# EAGLE board avocado_v1.0 (EAGLE 8.6.0)
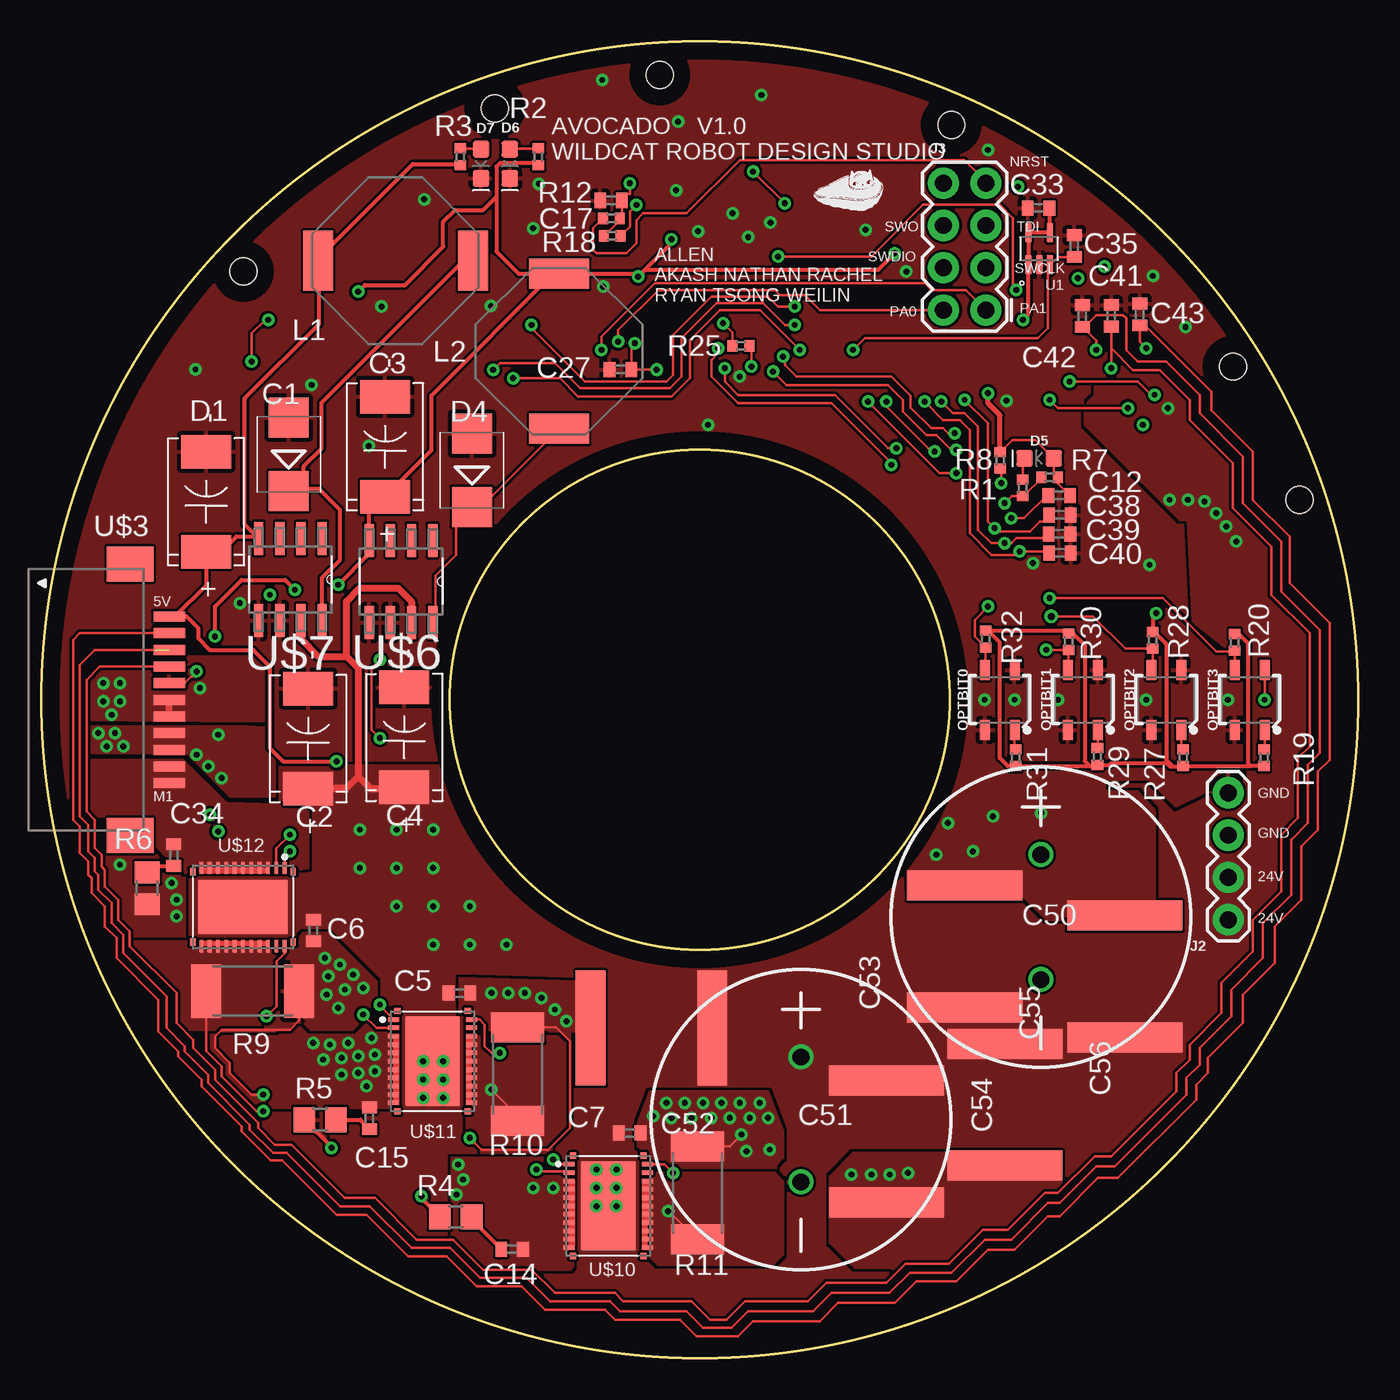
[diagram p2: board, top side]
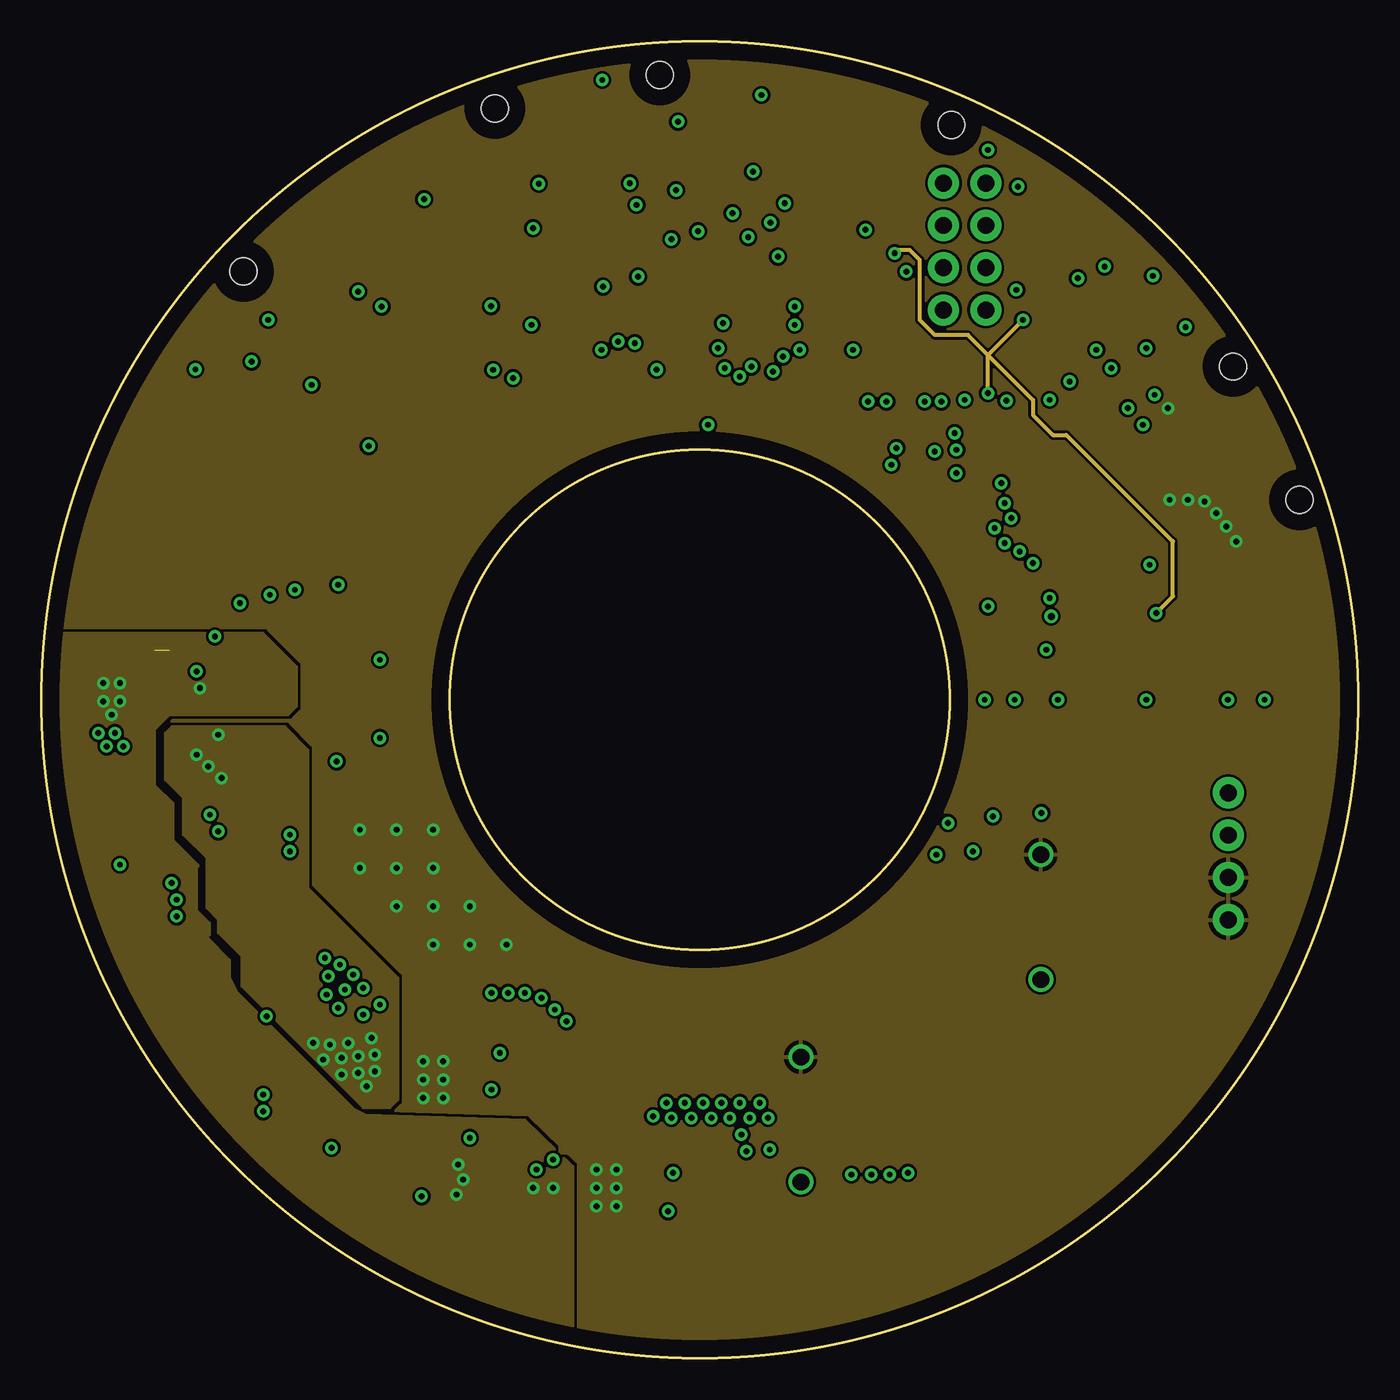
[diagram p3: board, inner layer Route2]
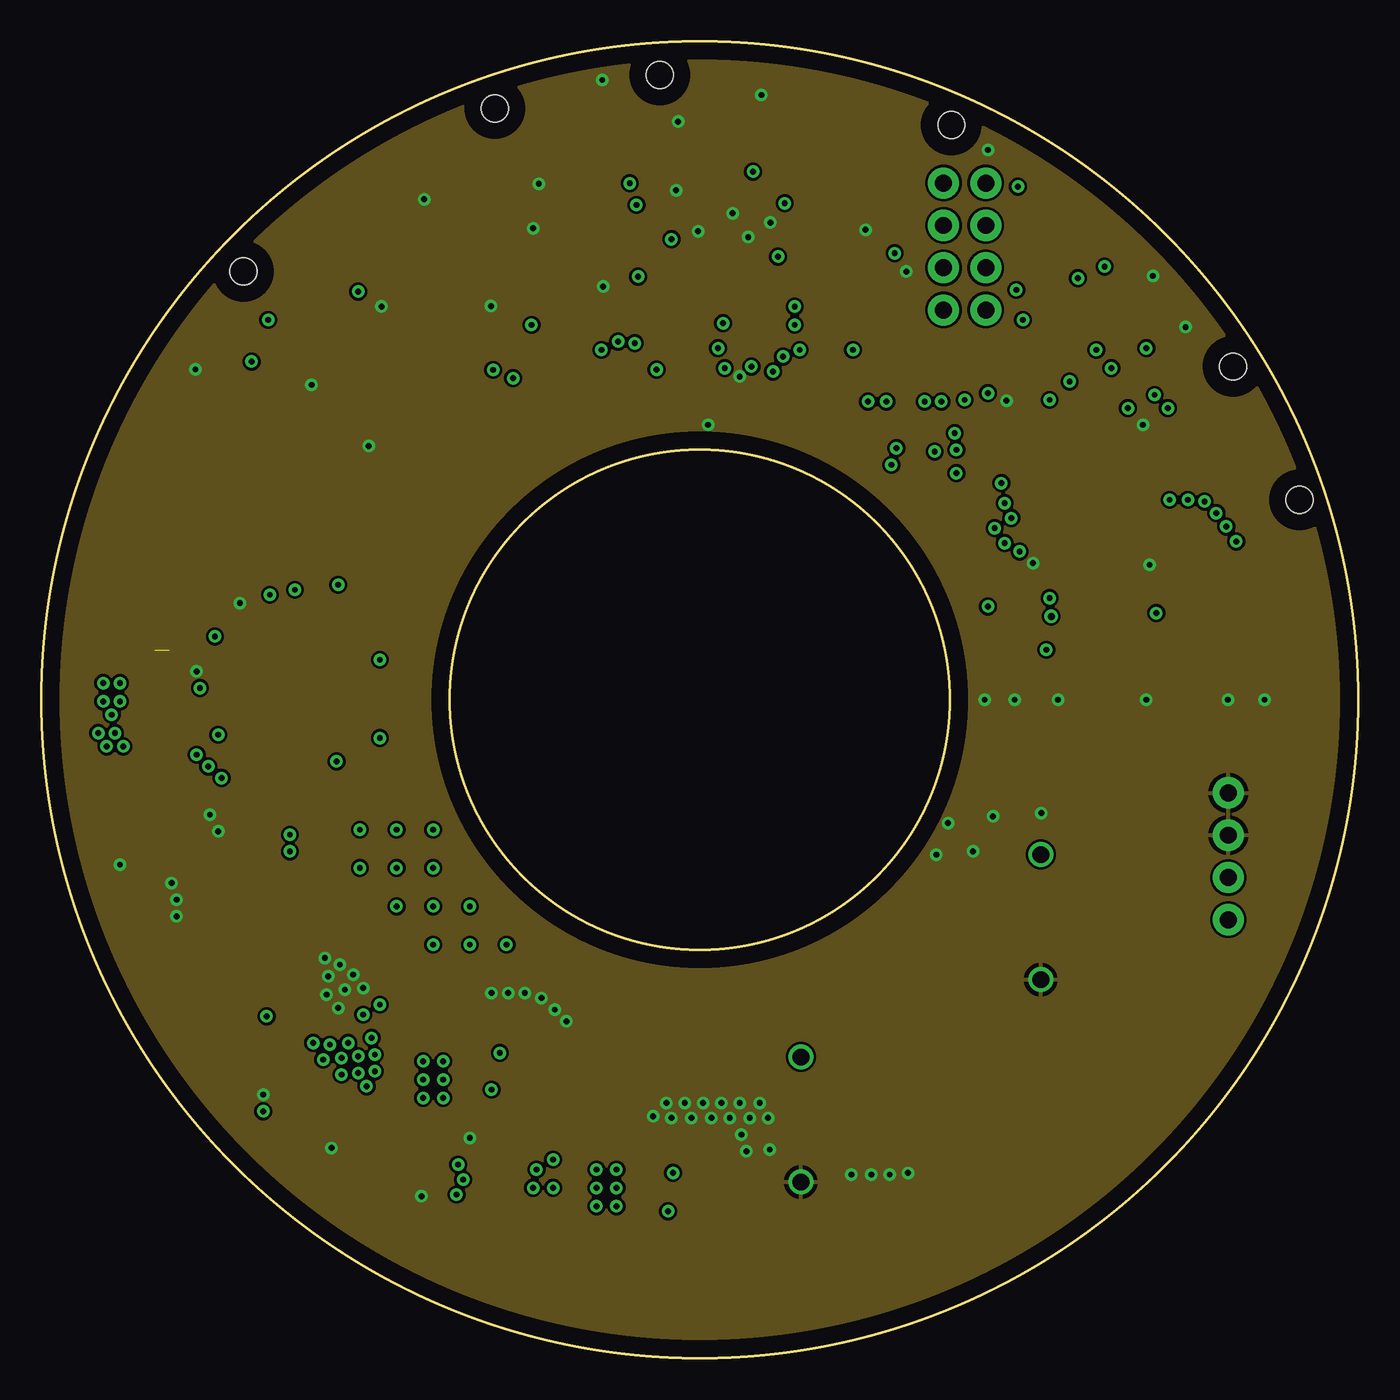
[diagram p4: board, inner layer Route15]
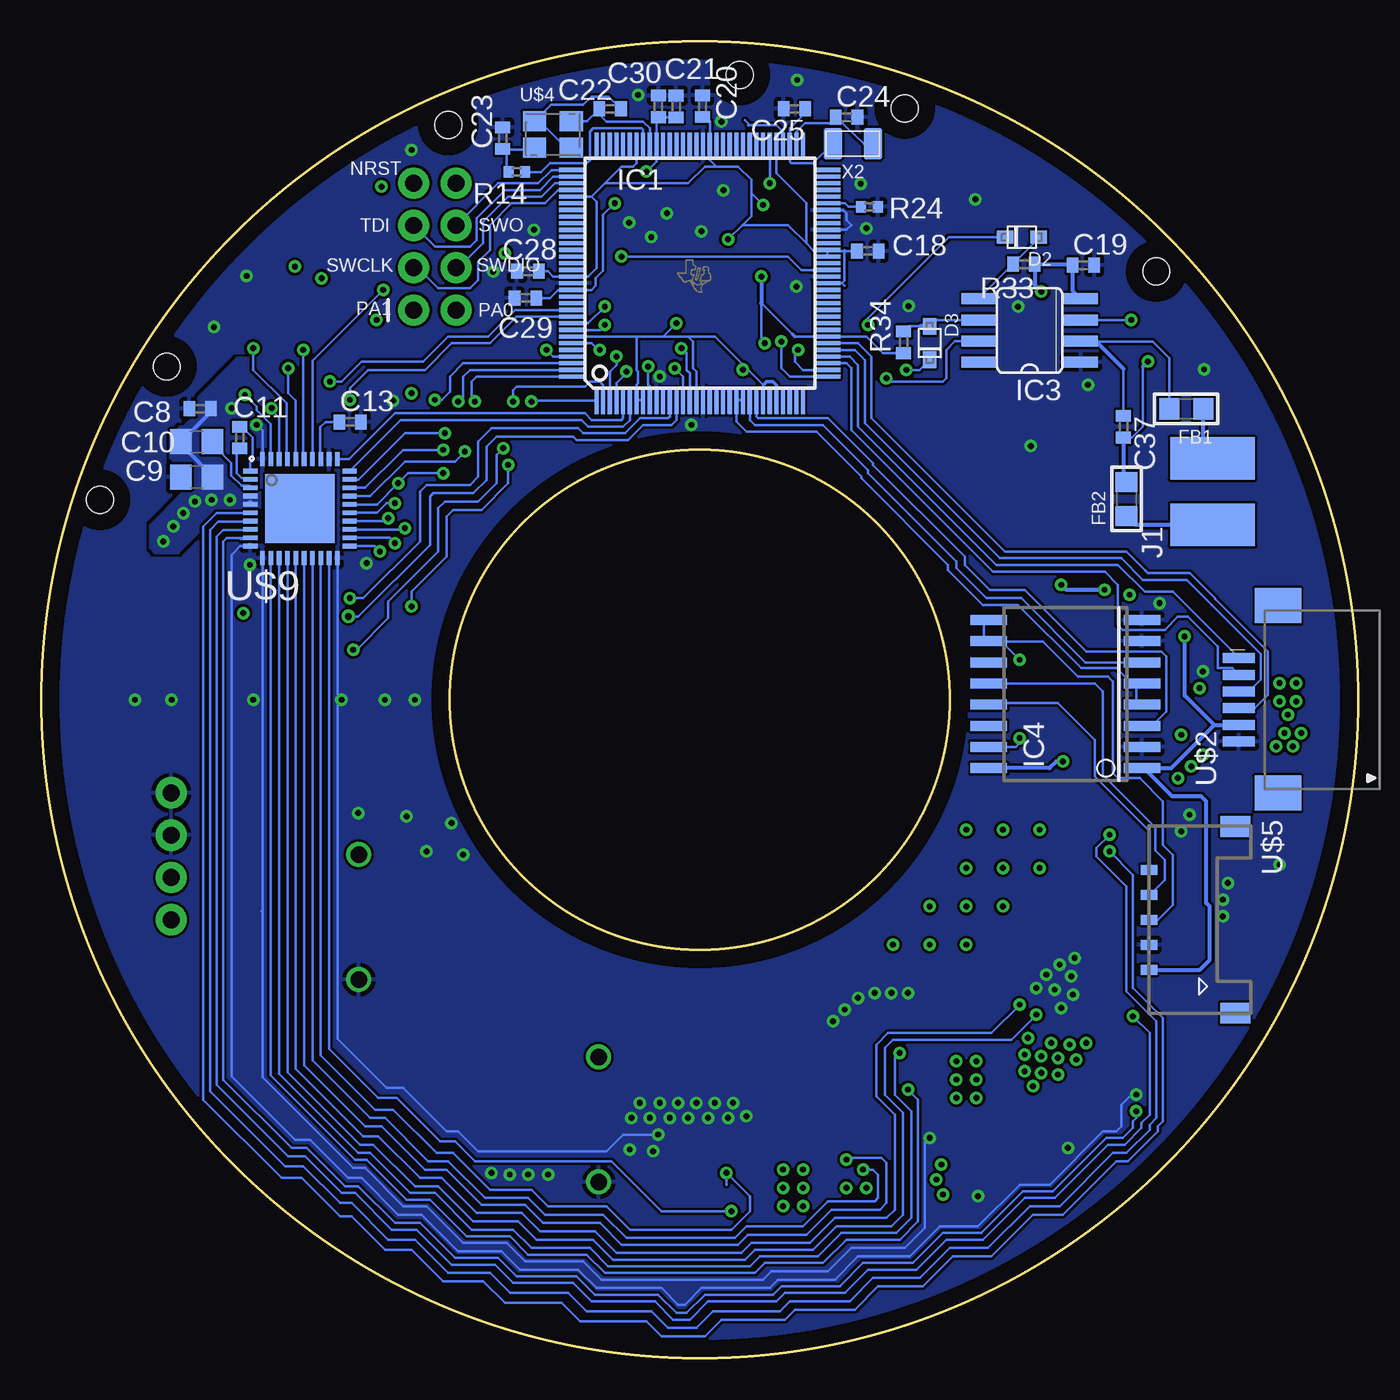
[diagram p5: board, bottom side, seen from below]

Size 79 x 79 mm. Coordinates in mm from the lower left corner, seen from the top.
Outline: circle at 39.5,39.5 radius 39.5
Outline: circle at 39.5,39.5 radius 15
Copper layers ((1*2)+(15*16)): Top 0.07mm / dielectric 0.36mm / Route2 0.0525mm / dielectric 0.71mm / Route15 0.0525mm / dielectric 0.36mm / Bottom 0.07mm
Design rules "default *": minimum track width 6mil, minimum drill 0.35mm, track to track 6mil, track to pad 6mil, pad to pad 6mil, via to via 6mil, smd to smd 6mil, copper to edge 40mil, drill to drill 6mil, minimum pad ring 10mil, minimum via ring 8mil, stop-mask expansion 4mil, vias tented up to drill 0mil, thermal gap 10mil
Holes 1.6 mm at 75.5,51.5 71.5,59.5 54.6,74 37.1,77 12.1,65.2 27.2,75

## Footprints (pad centres in the part's own frame; a part is rotated, then mirrored left to right if it is on the bottom)
2917-D = smd 2 x 3: + 3,0; - -3,0
C0402 = smd 0.7 x 0.9: 1 -0.65,0; 2 0.65,0
C0805 = smd 1.3 x 1.5: 1 -0.95,0; 2 0.95,0
UPJXXXXXMHD6 = drill 1: + -3.75,0; - 3.75,0
3025 = smd 1.8 x 6.9: P$1 -3.65,0; P$2 3.65,0
SMB = smd 2.4 x 2.4: A 2.2,0; C -2.2,0
SOD-323F = smd 1 x 0.8: A -1,0; C 1,0
LED-0603 = smd 1 x 1: A -0.877,0; C 0.877,0
_0805 = smd 1.2 x 1.3: 1 -1.016,0; 2 1.016,0
PDT_S-PQFP-G128 = smd 0.245 x 1.6: 1 -6.2,-7.65; 2 -5.8,-7.65; 3 -5.4,-7.65; 4 -5,-7.65; 5 -4.6,-7.65; 6 -4.2,-7.65; 7 -3.8,-7.65; 8 -3.4,-7.65; 9 -3,-7.65; 10 -2.6,-7.65; 11 -2.2,-7.65; 12 -1.8,-7.65; 13 -1.4,-7.65; 14 -1,-7.65; 15 -0.6,-7.65; 16 -0.2,-7.65; 17 0.2,-7.65; 18 0.6,-7.65; 19 1,-7.65; 20 1.4,-7.65; 21 1.8,-7.65; 22 2.2,-7.65; 23 2.6,-7.65; 24 3,-7.65; 25 3.4,-7.65; 26 3.8,-7.65; 27 4.2,-7.65; 28 4.6,-7.65; 29 5,-7.65; 30 5.4,-7.65; 31 5.8,-7.65; 32 6.2,-7.65; 65 6.2,7.65; 66 5.8,7.65; 67 5.4,7.65; 68 5,7.65; 69 4.6,7.65; 70 4.2,7.65; 71 3.8,7.65; 72 3.4,7.65; 73 3,7.65; 74 2.6,7.65; 75 2.2,7.65; 76 1.8,7.65; 77 1.4,7.65; 78 1,7.65; 79 0.6,7.65; 80 0.2,7.65; 81 -0.2,7.65; 82 -0.6,7.65; 83 -1,7.65; 84 -1.4,7.65; 85 -1.8,7.65; 86 -2.2,7.65; 87 -2.6,7.65; 88 -3,7.65; 89 -3.4,7.65; 90 -3.8,7.65; 91 -4.2,7.65; 92 -4.6,7.65; 93 -5,7.65; 94 -5.4,7.65; 95 -5.8,7.65; 96 -6.2,7.65 | smd 1.6 x 0.245: 33 7.65,-6.2; 34 7.65,-5.8; 35 7.65,-5.4; 36 7.65,-5; 37 7.65,-4.6; 38 7.65,-4.2; 39 7.65,-3.8; 40 7.65,-3.4; 41 7.65,-3; 42 7.65,-2.6; 43 7.65,-2.2; 44 7.65,-1.8; 45 7.65,-1.4; 46 7.65,-1; 47 7.65,-0.6; 48 7.65,-0.2; 49 7.65,0.2; 50 7.65,0.6; 51 7.65,1; 52 7.65,1.4; 53 7.65,1.8; 54 7.65,2.2; 55 7.65,2.6; 56 7.65,3; 57 7.65,3.4; 58 7.65,3.8; 59 7.65,4.2; 60 7.65,4.6; 61 7.65,5; 62 7.65,5.4; 63 7.65,5.8; 64 7.65,6.2; 97 -7.65,6.2; 98 -7.65,5.8; 99 -7.65,5.4; 100 -7.65,5; 101 -7.65,4.6; 102 -7.65,4.2; 103 -7.65,3.8; 104 -7.65,3.4; 105 -7.65,3; 106 -7.65,2.6; 107 -7.65,2.2; 108 -7.65,1.8; 109 -7.65,1.4; 110 -7.65,1; 111 -7.65,0.6; 112 -7.65,0.2; 113 -7.65,-0.2; 114 -7.65,-0.6; 115 -7.65,-1; 116 -7.65,-1.4; 117 -7.65,-1.8; 118 -7.65,-2.2; 119 -7.65,-2.6; 120 -7.65,-3; 121 -7.65,-3.4; 122 -7.65,-3.8; 123 -7.65,-4.2; 124 -7.65,-4.6; 125 -7.65,-5; 126 -7.65,-5.4; 127 -7.65,-5.8; 128 -7.65,-6.2
SO08 = smd 0.66 x 2.032: 1 -1.905,-3.073; 2 -0.635,-3.073; 3 0.635,-3.073; 4 1.905,-3.073; 5 1.905,3.073; 6 0.635,3.073; 7 -0.635,3.073; 8 -1.905,3.073
SOIC16 = smd 0.6 x 2.2: 1 -4.445,-4.6; 2 -3.175,-4.6; 3 -1.905,-4.6; 4 -0.635,-4.6; 5 0.635,-4.6; 6 1.905,-4.6; 7 3.175,-4.6; 8 4.445,-4.6; 9 4.445,4.6; 10 3.175,4.6; 11 1.905,4.6; 12 0.635,4.6; 13 -0.635,4.6; 14 -1.905,4.6; 15 -3.175,4.6; 16 -4.445,4.6
2_SMP = smd 2.54 x 5.08: 1 -2,0; 2 2,0
1X04 = drill 1.016 pad 1.88: 1 0,0; 2 2.54,0; 3 5.08,0; 4 7.62,0
2X4 = drill 1.016 pad 1.88: 1 -3.81,-1.27; 2 -3.81,1.27; 3 -1.27,-1.27; 4 -1.27,1.27; 5 1.27,-1.27; 6 1.27,1.27; 7 3.81,-1.27; 8 3.81,1.27
SRU1028 = smd 1.8 x 3.6: 1 -4.65,0; 2 4.65,0
QRE1113 = smd 1.2 x 0.6: 1 -1.8,-0.9; 2 1.8,-0.9; 3 1.8,0.9; 4 -1.8,0.9
R0402 = smd 0.6 x 0.7: 1 -0.5,0; 2 0.5,0
R0805 = smd 1.3 x 1.5: 1 -0.95,0; 2 0.95,0
R2512 = smd 1.8 x 3.2: 1 -2.8,0; 2 2.8,0
R0402' = smd 0.7 x 0.9: 1 -0.65,0; 2 0.65,0
SOT65P210X110-5N = smd 1.19 x 0.4: 1 -0.96,0.65; 2 -0.96,0; 3 -0.96,-0.65; 4 0.96,-0.65; 5 0.96,0.65
1MM-FPC-6PIN = smd 0.6 x 1.9: 1 -2.5,3.25; 2 -1.5,3.25; 3 -0.5,3.25; 4 0.5,3.25; 5 1.5,3.25; 6 2.5,3.25 | smd 2.1 x 2.8: THERMPAD 5.65,0.9; THERMPAD1 -5.6,0.9
1MM-FPC-11PIN = smd 0.6 x 1.9: 1 -5,3.25; 2 -4,3.25; 3 -3,3.25; 4 -2,3.25; 5 -1,3.25; 6 0,3.25; 7 1,3.25; 8 2,3.25; 9 3,3.25; 10 4,3.25; 11 5,3.25 | smd 2.1 x 2.8: THERMPAD 8.15,0.9; THERMPAD1 -8.15,0.9
NX3225GA = smd 1.4 x 1.2: P$1 1.1,0.8; P$2 -1.1,0.8; P$3 -1.1,-0.8; P$4 1.1,-0.8
5040500591 = smd 0.6 x 1: 1 3,-2.54; 2 1.5,-2.54; 3 0,-2.54; 4 -1.5,-2.54; 5 -3,-2.54 | smd 1.25 x 1.8: P$7 5.605,2.65; P$8 -5.605,2.65
SOIC127P620X175-8N = smd 1.981 x 0.559: 1 -2.464,1.905; 2 -2.464,0.635; 3 -2.464,-0.635; 4 -2.464,-1.905; 5 2.464,-1.905; 6 2.464,-0.635; 7 2.464,0.635; 8 2.464,1.905
DRV8323S = smd 0.28 x 0.85: AGND 1.75,2.975; CAL 2.25,2.975; DVDD 1.25,2.975; GHB -0.25,-2.975; GHC 0.25,-2.975; GLB -1.25,-2.975; GLC 1.25,-2.975; INHA 0.75,2.975; INHB -0.25,2.975; INHC -1.25,2.975; INLA 0.25,2.975; INLB -0.75,2.975; INLC -1.75,2.975; PGND -2.25,2.975; SHB -0.75,-2.975; SHC 0.75,-2.975; SNB -2.25,-2.975; SNC 2.25,-2.975; SPB -1.75,-2.975; SPC 1.75,-2.975 | smd 0.85 x 0.28: CPH -2.975,1.75; CPL -2.975,2.25; ENABLE 2.975,2.25; GHA -2.975,-0.25; GLA -2.975,-1.25; N_FAULT 2.975,-0.25; N_SCS 2.975,1.75; SCLK 2.975,1.25; SDI 2.975,0.75; SDO 2.975,0.25; SHA -2.975,-0.75; SNA -2.975,-2.25; SOA 2.975,-1.25; SOB 2.975,-1.75; SOC 2.975,-2.25; SPA -2.975,-1.75; VCP -2.975,1.25; VDRAIN -2.975,0.25; VM -2.975,0.75; VREF 2.975,-0.75 | smd 4.15 x 4.15: P$41 0,0
MOSFET_CSD88599Q5DC = smd 0.7 x 0.25: 1 -2.35,2.5; 2 -2.35,2; 3 -2.35,1.5; 4 -2.35,1; 5 -2.35,0.5; 6 -2.35,0; 7 -2.35,-0.5; 8 -2.35,-1; 9 -2.35,-1.5; 10 -2.35,-2; 11 -2.35,-2.5; 12 2.35,-2.5; 13 2.35,-2; 14 2.35,-1.5; 15 2.35,-1; 16 2.35,-0.5; 17 2.35,0; 18 2.35,0.5; 19 2.35,1; 20 2.35,1.5; 21 2.35,2; 22 2.35,2.5 | smd 0.43 x 0.375: 23 -2.115,3.013; 24 -2.115,-3.013; 25 2.115,-3.013; 26 2.115,3.013 | smd 3.3 x 5.4: 27 0,0
ABRACON-ABS07-32.768KHZ = smd 1.1 x 1.9: P$1 -1.2,0; P$2 1.2,0

## Placement (x,y rotation side)
C1  100u  [2917-D]  9.87,51.38 270 top
C2  15u  [2917-D]  16,37.16 270 top
C3  100u  [2917-D]  20.61,54.68 270 top
C4  15u  [2917-D]  21.77,37.25 270 top
C5  10nF  [C0402]  25.07,21.89 0 top
C6  10nF  [C0402]  16.31,25.65 270 top
C7  10nF  [C0402]  35.3,13.49 0 top
C8  0.1uF  [C0402]  69.48,56.97 180 bottom
C9  10uF  [C0805]  69.69,52.87 180 bottom
C10  1uF  [C0805]  69.7,54.98 0 bottom
C11  0.047uF  [C0402]  67.11,55.23 90 bottom
C12  0.1uF  [C0402]  61.07,51.77 180 top
C13  1uF  [C0402]  60.48,56.18 0 bottom
C14  4.7nF  [C0402]  28.24,6.52 180 top
C15  4.7nF  [C0402]  19.68,14.39 270 top
C17  0.1uF  [C0402]  34.17,69.47 180 top
C18  0.1uF  [C0402]  29.42,66.43 0 bottom
C19  10uF  [C0402]  16.48,65.58 0 bottom
C20  0.1uF  [C0402]  39.34,75.12 90 bottom
C21  0.1uF  [C0402]  40.92,75.11 90 bottom
C22  12pF  [C0402]  44.88,74.96 0 bottom
C23  12pF  [C0402]  51.32,73.21 90 bottom
C24  12pF  [C0402]  30.68,74.46 0 bottom
C25  12pF  [C0402]  33.82,74.97 180 bottom
C27  0.1uF  [C0402]  34.73,59.32 180 top
C28  0.1uF  [C0402]  49.82,65.22 180 bottom
C29  0.1uF  [C0402]  49.97,63.62 180 bottom
C30  2.2uF  [C0402]  41.98,75.12 90 bottom
C33  0.1uF  [C0402]  59.83,69.02 180 top
C34  4.7nF  [C0402]  7.93,30.18 270 top
C35  0.01uF  [C0402]  61.97,66.73 90 top
C37  0.01uF  [C0402]  14.07,55.89 270 bottom
C38  2200pF  [C0402]  61.12,50.59 0 top
C39  2200pF  [C0402]  61.09,49.45 0 top
C40  2200pF  [C0402]  61.12,48.31 0 top
C41  1000pF  [C0402]  64.2,62.55 90 top
C42  1000pF  [C0402]  62.45,62.54 90 top
C43  1000pF  [C0402]  65.9,62.63 90 top
C50  UPJXXXXXMHD6  [UPJXXXXXMHD6]  59.97,26.46 270 top
C51  UPJXXXXXMHD6  [UPJXXXXXMHD6]  45.57,14.31 270 top
C52  C7563  [3025]  36.6,19.8 180 top
C53  C7563  [3025]  55.4,24.7 90 top
C54  C7563  [3025]  50.7,13 270 top
C55  C7563  [3025]  65,22.9 90 top
C56  C7563  [3025]  57.8,15.2 270 top
D1  MBRS130LT3  [SMB]  14.83,54.23 90 top
D2  1n4148  [SOD-323F]  20.16,67.27 180 bottom
D3  1N4148  [SOD-323F]  25.7,60.91 270 bottom
D4  MBRS130LT3  [SMB]  25.82,53.27 90 top
D5  RED  [LED-0603]  59.87,53.99 180 top
D6  GREEN  [LED-0603]  28.1,71.67 270 top
D7  BLUE  [LED-0603]  26.37,71.67 270 top
FB1  Ferrite  [_0805]  10.3,56.96 180 bottom
FB2  Ferrite  [_0805]  13.89,51.55 90 bottom
IC1  TM4C129XXXPDT  [PDT_S-PQFP-G128]  39.5,65.1 0 bottom
IC3  MAX31855  [SO08]  19.7,61.66 90 bottom
IC4  ISO3088  [SOIC16]  17.56,39.84 90 bottom
J1  THERMOCOUPLE  [2_SMP]  8.72,51.99 90 bottom
J2  [1X04]  71.23,26.29 90 top
J3  [2X4]  55.4,66.7 90 top
L1  SRU1028  [SRU1028]  21.23,65.85 180 top
L2  SRU1028  [SRU1028]  31.06,60.41 90 top
OPTBIT0  [QRE1113]  57.5,39.5 90 top
OPTBIT1  [QRE1113]  62.5,39.5 90 top
OPTBIT2  [QRE1113]  67.5,39.5 90 top
OPTBIT3  [QRE1113]  72.5,39.5 90 top
R1  330  [R0402]  58.88,52.22 270 top
R2  330  [R0402]  29.81,72.09 90 top
R3  330  [R0402]  25.14,72.09 90 top
R4  2.21  [R0805]  24.85,8.46 0 top
R5  2.21  [R0805]  16.72,14.3 0 top
R6  2.21  [R0805]  6.34,28.19 90 top
R7  10K  [R0402]  60.5,52.85 0 top
R8  1.5K  [R0402]  57.52,53.87 90 top
R9  0.014  [R2512]  12.67,22.02 180 top
R10  0.014  [R2512]  28.56,17.02 270 top
R11  0.014  [R2512]  39.36,9.9 270 top
R12  10K  [R0402]  34.2,68.4 0 top
R14  2K  [R0402]  50.49,71.17 180 bottom
R18  10K  [R0402]  34.24,67.33 0 top
R19  100  [R0402]  73.36,36.02 270 top
R20  10K  [R0402]  71.61,42.95 90 top
R24  4.87K 1%  [R0402]  29.32,69.09 180 bottom
R25  [R0402]  41.97,60.74 180 top
R27  100  [R0402]  68.52,36.02 270 top
R28  10K  [R0402]  66.69,43.07 90 top
R29  100  [R0402]  63.37,36.09 270 top
R30  10K  [R0402]  61.63,42.99 90 top
R31  100  [R0402]  58.45,36.02 270 top
R32  10K  [R0402]  56.66,43.15 90 top
R33  10K  [R0402']  20.05,65.63 180 bottom
R34  10K  [R0402']  27.27,60.95 90 bottom
U1  LMT87DCKT  [SOT65P210X110-5N]  59.87,66.58 90 top
U$2  0522070633  [1MM-FPC-6PIN]  3.9,39.5 90 bottom
U$3  EC45FLAT_BLDC  [1MM-FPC-11PIN]  4.42,39.5 270 top
U$4  NX3225GA  [NX3225GA]  48.31,73.42 0 bottom
U$5  5040500591  [5040500591]  10,26.3 270 bottom
U$6  LM2594M-5.0  [SOIC127P620X175-8N]  21.57,46.6 270 top
U$7  LM2594M-5.0  [SOIC127P620X175-8N]  14.93,46.72 270 top
U$9  DRV8323SHOMEMADE  [DRV8323S]  63.5,50.98 0 bottom
U$10  CSD88584Q5DC  [MOSFET_CSD88599Q5DC]  34.01,9.12 0 top
U$11  CSD88584Q5DC  [MOSFET_CSD88599Q5DC]  23.46,17.81 0 top
U$12  CSD88584Q5DC  [MOSFET_CSD88599Q5DC]  12.09,27.06 270 top
X2  [ABRACON-ABS07-32.768KHZ]  30.31,72.88 180 bottom

## Tracks (layer width: path | path; a pad name or v marks a point on that pad's centre or on a via)
3V3DC  (via drill 0.35)
  Top 0.152: 35.4,59.31 C27.1 | 35.4,59.31 v36.91,59.31 | 29.9,71.66 R2.1 29.7,71.7 | 19.84,49.1 U$6.4 | 20.6,51.54 C3.+ | 30.7,65.06 L2.2 31.54,65.06 31.9,64.7 32,64.7 | C33.1 60.52,68.98 | v35.6,60.9 35.4,60.7 35.4,59.31 | v35.8,64.9 35.9,65 | 63.29,35.52 R29.2 63.31,35.59 | R32.2 56.8,43.65 | 61.47,43.65 R30.2 61.9,43.49 | 66.61,43.49 66.66,43.54 | 66.66,43.54 R28.2 | 71.48,43.57 R20.2 71.85,43.45 | 66.94,43.54 66.8,43.54 66.66,43.54 | R27.2 68.47,35.57 68.4,35.5 | C12.1 61,52.49 61,52.7 | 61,52.7 R7.2 | R25.2 41.47,61.53 v40.9,62.1 | v35.7,69.2 35.3,68.8 35.3,67.89 R18.2 | R8.2 58.25,55.1 59.64,55.1 D5.A 60.75,52.95 61,52.7
  Top 0.254: 29.7,71.7 27.5,71.7 27.3,71.5 27.3,69.7 | 27.3,69.7 27.3,66.4 28.64,65.06 30.7,65.06 23.4,57.76 23.4,54.47 C3.+ 19.66,50.74 U$6.4 | 60.52,68.98 U1.4 U1.5 U1.1 59.22,62.62 v58.9,62.3 | v17.8,46.4 19.67,48.27 U$6.4 | L2.2 35.64,65.06 v35.8,64.9 37.8,66.9 v37.8,67.14 | 62.9,35.52 R31.2 57.98,35.52 57.5,36 57.5,42.95 56.8,43.65 61.47,43.65 | 62.9,35.52 63.29,35.52 | R27.2 72.6,35.52 | 61.9,43.49 62.6,42.79 62.6,35.82 62.9,35.52 | 66.8,43.54 67.5,42.84 67.5,35.9 67.9,35.5 | 71.85,43.45 72.4,42.9 72.4,35.72 72.6,35.52 | R29.2 64.09,35.59 64.2,35.7 67.5,35.7 67.7,35.5 67.9,35.5 | 67.9,35.5 68.4,35.5 | v51.2,66.3 50.2,65.3 36.2,65.3 35.9,65 | v19,64 19.4,64.4 21.8,64.4 24.1,66.7 24.1,68.2 24.8,68.9 26.5,68.9 27.3,69.7 | R19.2 72.6,35.52 | v15.2,46.1 14.6,46.7 12,46.7 10.4,45.1 v10.4,43.3 | v66.9,44.7 66.69,44.48 R28.2
  Top 0.305: R8.2 57.52,56.58 56.8,57.3 v56.8,57.9
  Route2 0.152: 51.4,66.5 v51.2,66.3
  Route2 0.254: 56.8,60.2 v58.9,62.3 | v56.8,57.9 56.8,60.2 | 56.8,60.2 55.6,61.4 53.6,61.4 52.7,62.3 52.7,65.9 52.1,66.5 51.4,66.5 | 56.8,60.2 59.5,57.5 59.5,56.6 60.7,55.4 61.5,55.4 67.9,49 67.9,45.7 v66.9,44.7
  Bottom 0.152: C20.1 38.9,74.24 IC1.79 38.9,71.9 38.5,71.5 | 47.17,64.92 IC1.113 | 46,69.7 45.7,69.4 45.7,65.4 46.2,64.9 IC1.113 | IC1.101 46,69.7 | 46,69.7 45.2,70.5 | 45.2,70.5 44.2,71.5 43.5,71.5 43.3,71.7 IC1.90 | 30.81,66.43 C18.1 30.36,66.47 | 30.81,66.43 31.78,66.43 IC1.52 | 12.52,35.54 13.13,35.54 IC4.1 12.52,35.54 | 7.19,37.98 U$2.2 7.25,37.9 | 12.52,35.54 12.39,35.41 12.39,35.51 | 30.97,64.49 30.81,64.34 | 30.97,64.49 31.73,64.49 IC1.47 | 31.73,61.29 IC1.39 | 30.97,64.49 30.81,64.65 30.81,66.43 | 30.81,66.47 30.81,66.43 | 43.31,57.48 43,57.48 IC1.8 | 43.31,57.48 43.31,58.4 43.2,58.51 43.2,59.2 43.3,59.3 43.3,61.29 | 43.31,57.48 IC1.7 | IC1.122 47.12,61.29 43.3,61.29 | 36.76,59.46 35.69,58.4 35.69,57.48 IC1.26 | 36.76,59.46 v36.91,59.31 | IC1.69 34.9,71.1 33.1,69.3 33.1,66.9 | 33.1,66.9 32.7,66.5 IC1.52 | IC1.16 39.7,59.2 39.9,59.4 39.9,61 40.2,61.3 | 41.71,61.29 43.3,61.29 | 40.2,61.3 40.21,61.29 41.71,61.29 | 40.2,61.3 38.59,61.3 36.76,59.46 | 17.5,46.1 v17.8,46.4 | 33.95,61.45 35.8,63.3 35.8,61.1 v35.6,60.9 | 33.8,61.3 IC1.39 | 33.1,66.9 34.2,68 36.94,68 | 36.4,69.9 36.4,70.7 37.2,71.5 38.5,71.5 | 38.5,71.5 39.2,71.5 40.2,70.5 45.2,70.5 | v40.9,62.1 41.71,61.29 | C28.1 48.62,65.22 48.3,64.9 IC1.113 | IC1.52 IC1.51 | v35.7,69.2 36.4,69.9 | 17.18,65.63 C19.1 | R34.1 28.5,60.3 29.5,61.3 IC1.39 | 36.94,68 v37.8,67.14 | 36.4,69.9 36.4,68.54 36.94,68
  Bottom 0.2: 33.95,61.45 33.8,61.3 | 35.69,58.4 35.49,58.6 35.1,58.6 34.9,58.4 IC1.28
  Bottom 0.254: v15.2,46.1 17.5,46.1 | v35.8,64.9 35.8,63.3 | 17.18,65.63 R33.1 19.4,64.4 v19,64 | C19.1 17.13,64.07 IC3.4 | IC4.1 12.7,35.4 | 8.62,37.98 7.19,37.98 | 12.7,35.4 11.2,35.4 8.62,37.98 | 8.62,37.98 10.4,39.75 v10.4,43.3 | 12.3,23.3 9.5,23.3 8.9,23.9 8.9,27.1 9.1,27.3 9.1,33.4 9.4,33.7 11.14,33.7 12.7,35.26 12.7,35.4
  Bottom 0.305: U$5.1 12.3,23.3
5VDC  (via drill 0.35)
  Top 0.152: 25.02,71.66 R3.1 | 16.49,65.86 L1.2 16.64,65.71 | 11.15,48.49 9.93,48.49 C1.+ | 12.98,49.25 U$7.4 | U$3.1 8,44.5
  Top 0.254: 25.02,71.66 22.28,71.66 16.49,65.86 | v17.7,35.8 14.5,35.8 13.7,36.6 13.7,41.5 12.7,42.5 10.1,42.5 9.4,43.2 9.4,43.8 8.7,44.5 8,44.5 9.87,46.37 C1.+ 10.78,48.38 11.7,49.3 12.94,49.3 12.98,49.25 | U$7.4 12.2,50.01 12.2,57.6 16.64,62.04 16.64,65.71
  Bottom 0.254: v17.7,35.8 18.1,35.8 18.5,35.4 IC4.16
24VDC  (via drill 0.35)
  Top 0.152: 22.28,44.22 U$6.7 | 15.57,44.38 U$7.7 15.57,44.22 | 21.67,34.17 C4.+ | 16.18,34.17 16.03,34.17 C2.+ 16.1,34.16 16.18,34.17
  Top 0.305: 22.2,43.2 U$6.7 | 15.57,43.43 15.57,44.22 | C4.+ 21.2,34.24 20.77,33.81
  Top 0.406: U$7.7 15.57,43.13 16.6,42.1 18.3,42.1 | 16.1,34.16 18.26,34.16 19,34.9 | 19,34.9 19,41.4 18.3,42.1 | 19,34.9 19.73,34.17 21.67,34.17 | 18.3,42.1 18.3,45.4 19.1,46.2 21.4,46.2 22.2,45.4 U$6.7
  Bottom 0.152: 66.39,51.28 U$9.VDRAIN 66.55,51.28 | 68.53,52.81 C9.1 68.68,52.96 | 70.36,54.94 70.36,54.64 | 70.51,54.94 70.58,54.96 C10.1
  Bottom 0.254: C9.1 70.36,54.59 70.36,54.64 | C10.1 70.51,55.12 | 70.51,55.12 68.83,56.8 C8.1 | 70.51,55.12 70.51,55.1 | 70.51,55.1 70.51,54.94 | C10.1 70.63,54.98 70.51,55.1 | C10.1 70.6,54.98 70.58,54.96 | 70.51,54.94 70.61,54.94 C10.1 | 70.51,54.94 70.36,54.94
  Bottom 0.305: 66.47,51.36 66.55,51.28
  other vias: 19.1,31.7 21.3,31.7 23.5,31.7 19.1,29.4 21.3,29.4 23.5,29.4 21.3,27.1 23.5,27.1 25.7,27.1 23.5,24.8 25.7,24.8 27.9,24.8 24.1,15.6 24.1,16.7 24.1,17.8 22.9,15.6 22.9,16.7 22.9,17.8 33.3,9.1 33.3,10.2 33.3,11.3 34.5,9.1 34.5,10.2 34.5,11.3 67.7,51.5 68.8,51.5 69.8,51.4 70.5,50.7 71.1,49.9 71.7,49 67.6,57
  pour Route2 (rank 3): -11.5,82.5 -11.5,-1.5 87.4,-1.5 87.5,-1.6 87.5,82.5
  pour Top (rank 2, no thermals): 82,30.1 70.5,30.1 66.2,34.4 59.7,34.2 50.9,34.2 50.7,34 26.6,34 25.1,35.5 5.1,35.5 0.2,30.6 0.2,20 21.6,-1.4 57.1,-1.4 82.4,23.9 82.4,29.7
  pour Bottom (no thermals): 63.4,60 67.3,60 69.8,57.5 69.8,56.6 70.5,55.9 70.7,55.9 71.3,55.3 71.3,54 70.6,53.3 70.6,51.9 72.5,50 72.5,48.6 72.2,48.3 70.8,48.3 68.4,50.7 66.2,50.7 65.9,51 65.9,52.1 66,52.2 66,54.1 65.8,54.3 64.7,54.3 64.6,54.2 62.6,56.2 62.6,57.2 63.2,57.8 63.2,59.8
  pour Top (no thermals): 63.3,59.9 63.2,59.8 63.2,57.8 62.6,57.2 62.6,56 68.3,50.3 68.8,50.3 69.1,44.2 72.4,41.6 72.4,34.8 67.8,32.6 67.8,24 69.5,22.3 81.4,22.3 81.4,52.6 74.1,59.9
A
  Bottom 0.152: 21.82,40.41 22.43,40.41 IC4.12 15.78,40.48 15.3,40 15.3,35 | 15.3,34.9 15.3,35 | 15.3,35 12.15,31.85 12.15,30.45 11.6,29.9 11.6,28.7 12.5,27.8 U$5.4
B
  Bottom 0.152: IC4.13 22.43,39.2 21.97,39.2 21.87,39.3 18,39.3 15.8,37.1 15.8,34.9 12.5,31.6 12.5,29.34 U$5.5
CS
  Bottom 0.152: IC3.6 25.31,62.3 D3.A 26.96,61.91 R34.2
  Bottom 0.254: D3.A 26.26,61.91
DVDD
  Bottom 0.152: U$9.DVDD 62.28,54.03 62.28,55.86 61.95,56.18 C13.1
GH1  (via drill 0.35)
  Top 0.152: U$12.1 14.58,30.08 v14.9,30.4
  Bottom 0.152: U$9.GHA 66.5,50.7 68.5,50.7 69.3,49.9 69.3,15.5 64.6,10.8 63.4,10.8 61.1,8.5 60.4,8.5 58.4,6.5 56.8,6.5 54.9,4.6 52.5,4.6 51.2,3.3 47.8,3.3 46.7,2.2 42.7,2.2 41.8,1.3 39.2,1.3 38.2,2.3 34.4,2.3 33.8,2.9 30.2,2.9 28.8,4.3 26.1,4.3 24.3,6.1 22,6.1 19.5,8.6 17.7,8.6 14.5,11.8 13.8,11.8 12,13.6 12,13.9 11.7,14.2 11.7,20.4 13.5,22.2 13.5,29 v14.9,30.4
GH2  (via drill 0.35)
  Top 0.152: U$11.1 20.3,21.12 v20.3,21.2
  Bottom 0.152: v20.3,21.2 22,19.5 28.2,19.5 28.9,18.8 28.9,15.7 27.8,14.6 27.8,8.9 28.3,8.4 31.4,8.4 32.9,6.9 36.4,6.9 37,6.3 44.5,6.3 45.8,7.6 49.1,7.6 50.2,8.7 52.9,8.7 55,10.8 56.3,10.8 58.8,13.3 59.7,13.3 63.75,17.35 U$9.GHB
GH3  (via drill 0.35)
  Top 0.152: U$10.1 30.98,11.62 v30.7,11.9
  Bottom 0.152: v30.7,11.9 30.6,12 28.6,12 28.3,11.7 28.3,9.3 28.7,8.9 31.6,8.9 33.1,7.4 36.6,7.4 37.2,6.8 44.2,6.8 45.5,8.1 48.9,8.1 50,9.2 52.6,9.2 54.7,11.3 56,11.3 58.6,13.9 59.6,13.9 63.25,17.55 U$9.GHC
GL1  (via drill 0.35)
  Top 0.152: U$12.22 14.58,24.28 14.1,23.8 14.1,21.1 v13.5,20.5
  Bottom 0.152: v13.5,20.5 12.5,19.5 12.5,14.6 13,14.1 13,13.8 14,12.8 15,12.8 18.2,9.6 20,9.6 22.5,7.1 24.7,7.1 26.5,5.3 29.4,5.3 30.8,3.9 34.4,3.9 34.9,3.4 39,3.4 40.1,2.3 41.1,2.3 42.2,3.4 46,3.4 47.1,4.5 50.7,4.5 51.8,5.6 54.4,5.6 56.5,7.7 58,7.7 60.2,9.9 61,9.9 63.2,12.1 64.2,12.1 68.5,16.4 68.5,49.3 68.1,49.7 66.5,49.7 U$9.GLA
GL2  (via drill 0.35)
  Top 0.152: U$11.22 26.29,20.31 26.6,20 26.6,18.7 27,18.3 v27.5,18.3
  Bottom 0.152: v27.5,18.3 27.8,18 27.8,15.8 26.8,14.8 26.8,8.4 27.7,7.5 31,7.5 32.4,6.1 35.9,6.1 36.5,5.5 45,5.5 46.1,6.6 49.6,6.6 50.7,7.7 53.2,7.7 55.4,9.9 56.9,9.9 59.3,12.3 60,12.3 64.75,17.05 U$9.GLB
GL3  (via drill 0.35)
  Top 0.152: U$10.22 37.38,11.62 v37.9,11.1
  Bottom 0.152: 37.9,10.4 v37.9,11.1 36.5,9.7 36.5,8.8 37.6,7.7 43.7,7.7 45.1,9.1 48.6,9.1 49.6,10.1 52.1,10.1 54.3,12.3 55.3,12.3 57.9,14.9 59,14.9 62.25,18.15 U$9.GLC
GND  (via drill 0.35)
  Top 0.152: U$3.5 8.6,40.5 v9.3,41.2 | R9.1 15.47,20.27 14.9,19.7 10.8,19.7 10.4,19.3 10.4,18.6 11.3,17.7 11.3,17.1 12.6,15.8 v13.3,15.8 | R10.1 30.88,19.82 31.7,19 31.7,13.8 30.4,12.5 26.4,12.5 v25.7,13.2 | R11.1 41.3,12.7 v42,13.4 | OPTBIT3.2 v73.4,39.5
  Top 0.254: R5.1 17.4,12.66 v17.4,12.6 | R4.1 22.8,9.56 v22.8,9.7
  Bottom 0.152: C24.2 30.05,74.4 30.05,74.38 | IC1.55 30.7,67.7 30.4,68 30.7,68.3 30.7,68.7 30.9,68.9 IC1.58 | U$9.SNB 65.75,26.85 | 65.75,26.85 65.8,26.8 | v13.3,15.8 13.6,15.8 14.2,15.2 14.2,13.9 14.5,13.6 15.3,13.6 18.5,10.4 20.3,10.4 22.8,7.9 25.1,7.9 26.9,6.1 30,6.1 31.4,4.7 34.8,4.7 35.3,4.2 39.4,4.2 40.4,3.2 40.8,3.2 41.8,4.2 45.7,4.2 46.8,5.3 50.3,5.3 51.4,6.4 54,6.4 56.2,8.6 57.6,8.6 59.8,10.8 60.6,10.8 62.9,13.1 63.8,13.1 67.6,16.9 67.6,48.2 67.07,48.73 U$9.SNA | 65.75,26.85 65.75,16.85 60.3,11.4 59.6,11.4 57.3,9.1 55.9,9.1 53.7,6.9 51.1,6.9 50,5.8 46.5,5.8 45.4,4.7 35.7,4.7 35.2,5.2 31.8,5.2 30.4,6.6 27.2,6.6 26,7.8 26,12.9 v25.7,13.2 | v42,13.4 44.1,13.4 45.1,12.4 52.8,12.4 54,13.6 54.7,13.6 57.3,16.2 58.3,16.2 61.25,19.15 U$9.SNC | U$9.PGND 65.75,55.65 v66.1,56 | U$5.2 12.2,24.8
  other vias: 66.5,47.6 56.6,39.5 58.4,39.5 61,39.5 66.3,39.5 71.2,39.5 16.2,58.4 20.4,63.1 38.2,74.2 43.2,75.8 51.9,65.2 40,56 59.5,47.7 4.7,29.6 8.1,26.5 8.1,27.5 7.8,28.5 27,21.9 28,21.9 29,21.9 30,21.6 30.8,20.9 31.5,20.2 17,24 17.9,23.6 18.7,23 19.3,22.2 18.2,22.1 17.2,22.9 17.1,21.8 17.8,21 36.7,14.5 37.5,15.3 37.8,14.4 38.6,15.3 39,14.4 39.7,15.3 40.2,14.4 40.8,15.3 41.3,14.4 41.9,15.3 42.5,14.4 43.1,15.3 43.6,14.4 43.7,12.5 42.3,12.4 29.5,67.8 33.7,64.3 39.4,67.62 41.47,68.7 42.41,67.27 43.74,68.14 38.08,70.08 33.65,76.7 22.96,69.54 29.84,70.47 26.97,63.13 19.63,54.73 9.23,59.33 49.45,67.71 68.66,61.87 66.7,64.94 57.91,57.45 56.8,72.5 10.1,32.6 10.6,31.6 41.9,58.9 11.9,45.3 53.7,30.2 54.4,32.1 55.9,30.4 57.1,32.5 60,32.7 48.6,11 49.8,11 50.9,11 52,11.1
  pour Top (rank 3): -10.5,82.5 87.5,82.5 87.5,-1.5 -10.5,-1.5
  pour Bottom (rank 3): -14.5,82.5 87.5,82.5 87.5,-1.5 -14.5,-1.5
  pour Route15 (rank 3): -12.5,82.5 87.5,82.5 87.5,-1.5 -12.5,-1.5
  pour Top (no thermals): 15,24.8 15.7,25.5 17.2,25.5 20.1,22.6 20.1,21.3 18.6,19.8 16.3,19.8 15,21.1
  pour Top (no thermals): 25.6,19.8 25.1,20.3 25.1,22.8 32.1,22.6 32.9,20.9 32.7,19.5 30.6,19.7 26.5,19.7 26.4,19.8
  pour Top (no thermals): 36.1,12.4 35.8,12.7 35.8,14.1 36.5,16 43.6,16 44.5,13.6 44.5,12 44,11.5 36.4,11.5 36.1,11.8
  pour Top (no thermals): 8.6,28.7 8.6,25.7 8.3,25.4 5.4,25.4 3.2,27.6 3.2,32 3.4,32.1 5.5,32.1 5.6,31.2 6.3,30.6 8.1,28.8
  pour Top (no thermals): 47.3,10.9 47.3,6.9 48.8,5.4 54.7,5.4 56.3,7 56.7,7.4 58.1,7.4 60.2,9.5 61.2,9.5 61.2,12.3 54,12.3 48.7,12.3
  pour Top (no thermals): 52.1,32.7 53.6,34.2 65.8,34 66.7,33 66.8,32.8 66.8,26.6 61.5,26.6 61.2,26.3 60.3,26.3 58.8,27.8 52.5,27.8 52,28.3
GND_EXT  (via drill 0.35)
  Top 0.152: v20.3,37.2 19.8,37.7 19.8,41.4 v20.3,41.9
  Bottom 0.152: IC4.9 22.43,44.22 22.43,43.16 IC4.10 22.43,43 21.4,43 | 22.25,36.6 22.43,36.6 IC4.15 20.53,36.67 20.3,36.9 v20.3,37.2 | 22.25,36.6 21.9,36.6 | 21.9,36.6 21.82,36.6 | 21.4,43 18.9,43 16.8,40.9 15,40.9 14.7,40.6 14.7,35.1 14.4,34.8 13.1,34.8 11.7,33.4 11.7,30.8 11.1,30.2 11.1,27.2 12,26.3 U$5.3 | 21.93,36.64 21.9,36.6 | 22.86,36.64 22.29,36.64 22.25,36.6 | v20.3,41.9 21.4,43
H1  (via drill 0.35)  (1 unrouted)
  Top 0.152: v63.3,60.5 63.3,61.04 62.52,61.82 | 62.52,61.82 C42.1 | 62.52,61.82 63.3,62.6 64.9,62.6 65.1,62.4 65.1,60.5 65.8,59.8 67.5,59.8 69.5,57.8 69.5,56.7 72.1,54.1 72.1,51.3 74.4,49 74.4,46 76.7,43.7 76.7,36.3 76,35.6 76,32.1 75,31.1 75,27.8 73.3,26.1 73.3,24 71.4,22.1 71.4,20.5 69.5,18.6 69.5,17.6 68.7,16.8 68.7,15.8 64.4,11.5 63.3,11.5 61.1,9.3 60.4,9.3 58.2,7.1 56.6,7.1 54.6,5.1 52.1,5.1 50.9,3.9 47.4,3.9 46.3,2.8 42.4,2.8 41.4,1.8 39.7,1.8 38.7,2.8 34.7,2.8 34.1,3.4 30.5,3.4 29.1,4.8 26.3,4.8 24.5,6.6 22.2,6.6 19.7,9.1 17.9,9.1 14.7,12.3 13.9,12.3 12.5,13.7 12.5,14 10,16.5 10,17 8.6,18.4 8.6,18.7 7.5,19.8 7.5,21.7 4.9,24.3 4.9,25.4 4.2,26.1 4.2,27.3 3.4,28.1 3.4,29 3.2,29.2 3.2,30 2.8,30.4 2.8,32 2.3,32.5 2.3,41.6 3.2,42.5 6.8,42.5
  Bottom 0.152: 63.35,54.03 U$9.INLA 63.3,54 v63.3,60.5 63.3,60.6
H2  (via drill 0.35)
  Top 0.152: U$3.4 3.5,41.5 2.7,40.7 2.7,32.8 3.2,32.3 3.2,30.6 3.6,30.2 3.6,29.5 3.8,29.3 3.8,28.3 4.6,27.5 4.6,26.3 5.3,25.6 5.3,24.7 8.1,21.9 8.1,20.1 9.1,19.1 9.1,18.6 10.4,17.3 10.4,16.7 13,14.1 13,13.8 14,12.8 15,12.8 18.2,9.6 20,9.6 22.5,7.1 24.7,7.1 26.5,5.3 29.4,5.3 30.8,3.9 34.4,3.9 34.9,3.4 39,3.4 40.1,2.3 41.1,2.3 42.2,3.4 46,3.4 47.1,4.5 50.7,4.5 51.85,5.65 54.45,5.65 56.5,7.7 58,7.7 60.2,9.9 61,9.9 63.2,12.1 64.2,12.1 68.1,16 68.1,17.1 68.9,17.9 68.9,18.8 70.8,20.7 70.8,22.5 72.7,24.4 72.7,26.3 74.4,28 74.4,31.4 75.4,32.4 75.4,36 76.1,36.7 76.1,43.5 73.8,45.8 73.8,48.7 71.5,51 71.5,53.7 68.9,56.3 68.9,57.5 67.1,59.3 65.5,59.3 64.2,60.6 | 64.2,60.6 C41.1 | 64.2,60.6 v64.2,59.4
  Bottom 0.152: v64.2,59.4 64.2,57.9 63.75,57.45 U$9.INHB
H3  (via drill 0.35)
  Top 0.152: U$3.2 2.3,43.5 1.9,43.1 1.9,32.3 2.3,31.9 2.3,30.3 2.8,29.8 2.8,29 3,28.8 3,27.9 3.8,27.1 3.8,25.9 4.5,25.2 4.5,24 7,21.5 7,19.6 8.2,18.4 8.2,18.1 9.6,16.7 9.6,16.3 12,13.9 12,13.6 13.75,11.85 14.45,11.85 17.7,8.6 19.5,8.6 22,6.1 24.3,6.1 26.1,4.3 28.8,4.3 30.2,2.9 33.8,2.9 34.4,2.3 38.3,2.3 39.3,1.3 41.8,1.3 42.7,2.2 46.7,2.2 47.8,3.3 51.2,3.3 52.5,4.6 54.9,4.6 56.8,6.5 58.4,6.5 60.4,8.5 61.1,8.5 63.4,10.8 64.6,10.8 69.3,15.5 69.3,16.4 70,17.1 70,18 72.1,20.1 72.1,21.8 74,23.7 74,25.9 75.6,27.5 75.6,30.7 76.6,31.7 76.6,35.2 77.3,35.9 77.3,44.1 74.9,46.5 74.9,49.3 72.7,51.5 72.7,54.4 70.2,56.9 70.2,58 66.22,61.98 C43.1 65.9,61 v66.3,60.6
  Bottom 0.152: U$9.INLB 64.26,54.03 64.3,54.07 64.3,57.3 66.3,59.3 v66.3,60.6
ISENS1  (via drill 0.35)
  Top 0.152: U$12.19 U$12.18 | R9.2 9.87,18.43 10.8,17.5 10.8,16.9 12.9,14.8 v13.3,14.8
  Bottom 0.152: 67.05,49.15 66.55,49.15 U$9.SPA 66.5,49.2 67.9,49.2 68.1,49 68.1,16.7 64,12.6 63.1,12.6 60.8,10.3 60,10.3 57.8,8.1 56.3,8.1 54.2,6 51.6,6 50.5,4.9 46.9,4.9 45.8,3.8 42,3.8 40.9,2.7 40.3,2.7 39.2,3.8 35.1,3.8 34.6,4.3 31.1,4.3 29.7,5.7 26.7,5.7 24.9,7.5 22.6,7.5 20.1,10 18.3,10 15.1,13.2 14.1,13.2 13.5,13.8 13.5,14.2 13.3,14.4 v13.3,14.8
  pour Top (no thermals): 5.1,25 4.9,24.8 4.9,23.6 8.8,19.7 13.9,19.7 14.6,20.4 14.6,25
ISENS2  (via drill 0.35)
  Top 0.152: R10.2 28.56,14.54 v27,16.1
  Top 0.254: U$11.20 U$11.19
  Bottom 0.152: v27,16.1 26.4,15.5 26.4,8.2 27.5,7.1 30.7,7.1 32.1,5.7 35.6,5.7 36.2,5.1 45.2,5.1 46.3,6.2 49.8,6.2 50.9,7.3 53.5,7.3 55.7,9.5 57.1,9.5 59.5,11.9 60.2,11.9 65.25,16.95 U$9.SPB 65.3,47.95
  pour Top (no thermals): 25.5,13.5 26.5,12.5 30.4,12.5 31.7,13.8 31.7,18.6 31,19.3 25.5,19.3
ISENS3  (via drill 0.35)
  Top 0.152: R11.2 37.67,8.8 v37.6,8.8
  Top 0.305: U$10.15 U$10.16 U$10.17 U$10.18 U$10.19 U$10.20
  Bottom 0.152: v37.6,8.8 41.8,8.8 44.8,11.8 53,11.8 54.2,13 55.1,13 57.7,15.6 58.8,15.6 61.75,18.55 U$9.SPC
  pour Top (no thermals): 36.4,11.1 44,11.1 44.5,10.6 44.5,6.2 43.9,5.6 37,5.6 36.1,6.4 36.1,10.9
M1
  pour Top (no thermals): 8.4,29.1 6,31.6 6,32.5 3,32.5 2.7,32.8 2.7,35.7 2.9,35.9 8.5,35.9 11.1,33.3 15.3,33.2 16,32.8 16,29.4 14.4,29.1
M2  (via drill 0.35)
  other vias: 10.6,37.4 16.3,18.9 16.9,17.9 17.3,18.8 18,18 18.4,18.9 19,18.1 19.8,19.2 20,18.2 20,17.2 19.5,16.3 19,17.1 18,17 9.3,36.2 10,35.5 10.8,34.8 3.4,37.5 4.4,37.5 3.9,36.7 4.9,36.7
  pour Top (no thermals): 0.4,38 4,37.9 12.3,37.9 14,37.8 14,33.7 11.3,33.7 8.7,36.3 0,36.3 -0.3,36.5 -0.3,37.8 0,38
  pour Top (no thermals): 21.4,20.2 20.7,20.9 20.3,20.9 18.8,19.4 16,19.4 15.4,20 14.9,20 14.2,19.3 10.4,19.3 10.4,18.6 11.3,17.7 11.3,17.1 13.4,15 20.8,15 21.4,15.6
  pour Route2: 20.9,15 19.3,15 12,22.3 12,24.1 10.6,25.5 10.6,26.3 9.9,27 9.9,30 8.5,31.4 8.5,33.6 7.4,34.7 7.4,37.5 7.8,37.9 14.6,37.9 16,36.5 16,28.2 21.4,22.8 21.4,15.5
M3  (via drill 0.35)
  Top 0.406: U$3.7 U$3.6
  other vias: 9.5,40.2 29.5,10.2 30.7,10.2 3.7,40.5 4.7,40.5 4.7,39.4 4.2,38.6 3.7,39.4 25,11.6 25.3,10.7 24.9,9.8
  pour Top (no thermals): 0.9,38.3 13.8,38.2 14.2,38.9 14.2,42.1 0,42.1 -0.3,41.8 -0.3,39.4
  pour Top (no thermals): 31.9,11.5 31.4,12 24.6,12 24.6,7.2 26.5,5.3 31.7,5.3 31.9,5.5
  pour Route2: 31.9,11.5 29,14.3 19.4,14.6 18.8,14.9 11.7,22 11.3,22.8 11.3,23.9 10,25.2 9.9,25.2 10.1,25.4 10.1,26.1 9.3,26.9 9.3,29.4 9.4,29.5 9.4,29.6 7.9,31.1 7.9,33.3 6.8,34.4 6.8,37.7 7.7,38.6 14.8,38.6 15.3,39.1 15.3,41.5 13.3,43.5 -0.6,43.5 -0.7,43.6 -0.7,21 20.5,-0.2 31.9,-0.2
N$1
  Top 0.254: R6.2 6.73,29.53 C34.2
N$2
  Bottom 0.152: U$9.VCP 66.55,52.35 67,52.35 67.61,52.96 67.61,53.71 68.53,54.63 68.53,54.94 C10.2
N$3
  Bottom 0.152: U$9.CPH 66.55,52.81 67,52.81 67.3,53.1 67.3,54.39 C11.1 66.85,54.48
N$4
  Top 0.152: OPTBIT3.1 73.4,36.55 R19.1
N$5  (via drill 0.35)
  other vias: 63.8,65.5
N$6
  Bottom 0.152: 66.78,55.88 66.9,55.88 | 66.9,55.88 C11.2 | U$9.CPL 66.47,53.72 66.35,53.85 | 66.35,53.85 66.3,53.9 | 66.35,53.85 66.35,55.25 66.9,55.8 66.9,55.88
N$7
  Top 0.152: R2.2 29.75,72.57 28.22,72.57 D6.A
N$8
  Top 0.152: 58.98,54.08 D5.C 58.88,53.88 R1.1 59.09,52.83
N$9
  Top 0.152: OPTBIT2.1 68.4,36.63 R27.1
N$10  (via drill 0.35)
  other vias: 62.2,64.8
N$11  (via drill 0.35)
  other vias: 58.6,70.3
N$12
  Top 0.152: OPTBIT1.1 63.4,36.63 R29.1
N$13
  Bottom 0.254: J1.2 9.29,54.56 FB1.1
N$14
  Top 0.152: OPTBIT0.1 58.4,36.57 R31.1
N$15
  Bottom 0.152: C37.1 14.07,59.37 | FB1.2 11.32,60.02 12.3,61 16.6,61
  Bottom 0.254: FB1.2 11.74,56.54 | 14.07,59.37 15.8,61.1 15.87,61.03 IC3.2 16.6,61
N$16
  Bottom 0.254: J1.1 13.35,49.99 FB2.1
N$17  (via drill 0.35)
  Top 0.152: v12.6,59.8 12.6,61.5 13.4,62.3
  Top 0.254: 13.4,62.3 v13.6,62.3
  Bottom 0.152: C37.2 13.56,55.24 12.9,55.9 12.9,59.5 | v13.6,62.3 IC3.3
  Bottom 0.254: C37.2 14.07,52.74 FB2.2 | 12.9,59.5 v12.6,59.8 | IC3.3
N$18  (via drill 0.35)
  other vias: 13.7,45.8
N$19
  Top 0.152: R3.2 25.17,72.57 26.24,72.57 D7.A
N$22  (via drill 0.35)
  Top 0.152: v58.2,50.4 58.95,50.4 60.32,51.77 C12.2
  Bottom 0.152: U$9.VREF 58.37,50.23 v58.2,50.4
N$24
  Top 0.152: 25.17,65.71 25.78,65.71 L1.1 | U$7.8 16.94,44.38 U$7.8 | 14.96,52.15 D1.C 14.95,52.15 14.96,52.15
  Top 0.254: 25.17,65.71 16.79,57.33 16.79,54.59 15.73,53.52 15.73,52.15 | U$7.8 16.84,46.84 17.9,47.9 17.9,50.9 16.65,52.15 15.73,52.15 | 15.73,52.15 14.96,52.15
N$25
  Top 0.152: U$6.8 23.65,44.22 23.65,46.97 24.87,48.19 24.87,50.02 25.78,50.93 D4.C 25.94,51.08 26.39,51.08 30.97,55.65 L2.1
N$40
  Top 0.152: R4.2 25.8,8.31
  Top 0.254: 25.8,8.31 C14.2
N$41
  Top 0.254: R5.2 19.12,14.29 C15.2
N$42
  Bottom 0.152: 47.28,72.42 U$4.P$4 | 47.81,72.62 U$4.P$4 | U$4.P$4 47.52,72.62 49.12,74.22 U$4.P$2 48.43,75.2 46.5,75.2 46,75.7 44.96,75.7 C22.2
N$45
  Bottom 0.152: 51.19,72.42 51.28,72.52 | 51.28,72.52 C23.1 51.08,72.57 51.08,71.2 R14.2 | U$4.P$3 49.52,72.52 51.28,72.52
NFAULT  (via drill 0.35)
  Top 0.152: R7.1 60.1,52.84 R1.2 58.22,51.72 v57.8,51.3
  Bottom 0.152: U$9.N_FAULT 58.87,50.73 58.3,51.3 v57.8,51.3
NRST  (via drill 0.35)
  Top 0.152: 35.3,69.95 35.3,69.85 | 33.64,67.37 R18.1 34.67,68.26 34.67,68.4 R12.2 34.82,68.52 C17.1 35.3,69.95 | 35.3,69.95 v35.3,70.5
  Bottom 0.152: IC1.70 v35.3,70.5
NTRST
  Top 0.152: J3.7 56.67,70.63 55.4,71.9 41.9,71.9 38.7,68.7 36.1,68.7 35.7,68.3 35.7,66.9 35.1,66.3 33.3,66.3 33.1,66.5 33.1,67.8 R12.1
NWAKE
  Bottom 0.152: IC1.64 32.6,71.3
OSC0
  Bottom 0.152: IC1.88 42.5,73.8 42.9,74.2 45.1,74.2 45.53,74.63 C22.1 46.27,74.22 U$4.P$1
OSC1
  Bottom 0.152: R14.1 49.03,71.17 48.5,71.7 46.3,71.7 46.1,71.9 46.1,73.6 45.9,73.8 43,73.8 42.9,73.7 IC1.89
PA0  (via drill 0.35)
  Top 0.152: v34.6,61 34.6,61.69 37.01,64.1 44,64.1 44.3,63.8 45.8,63.8 46.71,62.89 J3.2
  Bottom 0.152: IC1.33 34.1,58.9 34.6,59.4 v34.6,61
PA1  (via drill 0.35)
  Top 0.152: J3.1 55.46,64.1 53.4,64.1 53,64.5 36.8,64.5 33.6,61.3 v33.6,60.5
  Bottom 0.152: IC1.34 33.3,59.3 33.8,59.8 33.8,60.3 v33.6,60.5
PA2
  Bottom 0.152: U$2.5 7.55,41.4 8.4,41.4 8.4,42.7 10.2,44.5 10.8,44.5 11.6,43.7 14.1,43.7 14.4,44 14.4,46.4 15.2,47.2 21.9,47.2 30.4,55.7 30.4,59.4 30.7,59.7 IC1.35
PA3
  Bottom 0.152: IC1.36 31.73,60.07 31.7,60.1 30.5,60.1 30,59.6 30,55.9 21.7,47.6 14.4,47.6 12.8,46 11.1,46 7.19,42.09 U$2.6
PA4
  Bottom 0.152: IC1.37 31.73,60.53 31.7,60.5 30.2,60.5 29.6,59.9 29.6,56.1 21.5,48 14.8,48 14.2,48 12.9,46.7 10.28,46.7 8.78,45.2 5.82,42.24 5.82,40.72 6.43,40.11 7.04,40.11 U$2.4
PA5
  Bottom 0.152: U$2.3 6.2,39 5.4,39.8 5.4,42.4 8.55,45.55 8.6,45.6 10.1,47.1 12.6,47.1 12.7,47.2 12.75,47.25 13.9,48.4 14.6,48.4 21.2,48.4 29.2,56.4 29.2,60.1 30,60.9 IC1.38
PB4  (via drill 0.35)
  Top 0.152: v27.1,59.3 27.5,59.7 30.8,59.7 32.3,58.2 37.7,58.2 38.4,58.9 38.4,61.2 40.5,63.3 43.3,63.3 44.6,62 v45.2,62
  Bottom 0.152: D3.C 26.31,59.3 v27.1,59.3 | v45.2,62 45.5,61.7 IC1.121
PB5  (via drill 0.35)
  Top 0.152: v45.2,63.1 44.2,63.1 43.6,63.7 40.2,63.7 37.9,61.4 37.9,59 37.5,58.6 32.6,58.6 29.4,61.8 v29.4,62
  Bottom 0.152: D2.C 24.53,67.27 29.4,62.4 v29.4,62 | v45.2,63.1 46.2,62.1 IC1.120
PC4
  Bottom 0.152: IC4.3 12.36,37.94 11.5,38.8 11.5,42.1 11.8,42.4 16.3,42.4 20,46.1 22.1,46.1 23.6,47.6 23.6,48.1 29.1,53.6 29.1,53.7 31.8,56.4 36,56.4 36.1,56.5 IC1.25
PC5
  Bottom 0.152: IC4.6 16.35,41.75 20.2,45.6 22.3,45.6 24.1,47.4 24.1,47.8 29.4,53.1 29.4,53.3 32.1,56 36.2,56 36.5,56.3 IC1.24
PC6
  Bottom 0.152: IC4.4 13.29,39.35 13.29,40.41 IC4.5 13.58,40.48 14.5,41.4 16.6,41.4 20.4,45.2 22.5,45.2 24.6,47.3 24.6,47.6 29.8,52.8 29.8,52.9 32.5,55.6 36.7,55.6 37.3,56.2 IC1.22 37.21,57.48 36.91,57.48 IC1.23
PD0  (via drill 0.35)
  Top 0.152: v49.6,57.4 53.9,53.1 v54.9,53.1 | R8.1 57.6,53.29 v57.6,52.5
  Bottom 0.152: 45.75,57.33 IC1.1 49.55,57.45 v49.6,57.4 | v54.9,53.1 57,53.1 v57.6,52.5 58.87,51.23 U$9.SDO
PD1  (via drill 0.35)
  Top 0.152: v50.7,57.4 50.7,57.1 53.4,54.4 v53.6,54.4
  Bottom 0.152: U$9.SDI 59.27,51.73 57.2,53.8 54.2,53.8 v53.6,54.4 | IC1.2 45.3,58.4 45.5,58.6 46.1,58.6 46.4,58.3 50.5,58.3 50.7,58.1 v50.7,57.4
PD2  (via drill 0.35)
  Top 0.152: v54.8,55.5 54.4,55.5 54.1,55.8 53.4,55.8 52.15,57.05 52.15,57.75 51,58.9 45.3,58.9 44.6,59.6 44.6,60 v44.5,60.1
  Bottom 0.152: U$9.N_SCS 59.97,52.73 57.2,55.5 v54.8,55.5 | IC1.3 44.9,59.2 44.5,59.6 v44.5,60.1
PD3  (via drill 0.35)
  Top 0.152: v54.9,54.5 54.6,54.5 53.7,55.4 53.1,55.4 51.7,56.8 51.7,57.5 50.8,58.4 44.7,58.4 v43.9,59.2
  Bottom 0.152: U$9.SCLK 59.57,52.23 57.45,54.35 57.3,54.5 v54.9,54.5 | IC1.4 44.5,58.5 43.9,59.1 v43.9,59.2
PD4  (via drill 0.35)
  Top 0.152: v48.7,60.5 49.4,61.2 59.8,61.2 60.4,61.8 60.4,65.49 U1.3 60.99,66.08 C35.1
  Bottom 0.152: 47.27,60.07 IC1.125 48.3,60.1 v48.7,60.5
PD5  (via drill 0.35)
  Top 0.152: v55.4,57.5 56.8,56.1 56.8,50.2 v57.2,49.8 57.4,49.6 59.3,49.6 59.9,50.2 60.09,50.2 60.44,50.55 | C38.1 60.44,50.55 | 60.44,50.55 60.18,50.2
  Bottom 0.152: IC1.126 53.7,59.7 54.5,58.9 54.5,58 55,57.5 v55.4,57.5 | U$9.SOA 57.27,49.73 v57.2,49.8
PD6  (via drill 0.35)
  Top 0.152: C39.1 60.19,49.2 58.5,49.2 58.2,48.9 v57.8,48.9 57,48.9 56.2,49.7 56.2,55.9 55.4,56.7 54.7,56.7 v54,57.4
  Bottom 0.152: 60.45,49.3 U$9.SOB 58.13,49.23 v57.8,48.9 | 47.27,59.31 IC1.127 53.3,59.3 53.7,58.9 53.7,57.7 v54,57.4
PD7  (via drill 0.35)
  Top 0.152: C40.1 60.38,48.4 v58.7,48.4 58.5,48.2 57,48.2 55.7,49.5 55.7,55.7 55.1,56.3 54.1,56.3 v53,57.4
  Bottom 0.152: 60.5,48.7 U$9.SOC 59.03,48.73 v58.7,48.4 | v53,57.4 53.2,57.6 53.2,58.6 52.9,58.9 IC1.128
PE0  (via drill 0.35)
  Top 0.152: v51,53.6 51,53.7 47.4,57.3 42.4,57.3 42.3,57.3 41.8,57.3 40.2,58.9 40.2,59.9 40.6,60.3 v40.6,60.6 | 56.85,42.65 R32.1 | OPTBIT0.3 56.7,41.4 56.66,41.45 R32.1 | v56.8,45.1 56,44.3 56,43.3 R32.1
  Bottom 0.152: IC1.15 40.1,59.1 40.3,59.3 40.3,60.3 v40.6,60.6 | v51,53.6 51,52.5 52.6,50.9 54.3,50.9 54.7,50.5 54.7,48.1 56.8,46 v56.8,45.1
PE1  (via drill 0.35)
  Top 0.152: v51.3,54.6 50.8,54.6 47.6,57.8 41.8,57.8 41,58.6 v41,59.4 | OPTBIT1.3 61.63,41.33 R30.1 v60.3,42.5
  Bottom 0.152: IC1.14 40.5,58.9 v41,59.4 | v51.3,54.6 51.7,54.2 51.7,52.5 52.8,51.4 54.8,51.4 55.2,51 55.2,48.4 58.2,45.4 58.2,44.4 60.1,42.5 v60.3,42.5
PE2  (via drill 0.4)
  Top 0.152: OPTBIT2.3 66.69,41.38 R28.1 65.03,42.57 63.1,44.5 v60.6,44.5
  Bottom 0.152: 40.87,57.48 IC1.13 40.9,56.3 41.2,56 42.9,56 43.8,55.1 46.9,55.1 47.1,55.3 51.7,55.3 52.3,54.7 52.3,52.7 53.1,51.9 55.5,51.9 55.7,51.7 55.7,48.8 60,44.5 v60.6,44.5
PE3  (via drill 0.35)
  Top 0.152: R20.1 71.6,42.4 | 71.6,42.4 OPTBIT3.3 | v60.5,45.6 67.3,45.6 70.5,42.4 71.6,42.4
  Bottom 0.152: 41.33,57.48 IC1.12 41.3,56.5 41.4,56.4 43.1,56.4 44,55.5 46.5,55.5 46.8,55.8 52,55.8 52.8,55 52.8,52.9 53.3,52.4 55.9,52.4 56.3,52 56.3,49 59.7,45.6 v60.5,45.6
PE4  (via drill 0.35)
  Top 0.152: v28.3,58.8 31.1,58.8 32.2,57.7 37.8,57.7 38.9,58.8 38.9,61.1 40.7,62.9 43.1,62.9 v45.5,60.5
  Bottom 0.152: IC3.7 24.17,61.03 24.7,60.5 24.7,58.8 24.9,58.6 28.1,58.6 v28.3,58.8 | v45.5,60.5 45.6,60.5 46,60.9 IC1.123
PE5
  Bottom 0.152: 47.27,60.53 IC1.124
PG0  (via drill 0.35)
  Top 0.152: v44.2,66.1 49.8,66.1 52.9,69.2 57.5,69.2 58.3,68.4 58.3,64.3 v58.5,64.1
  Bottom 0.152: IC1.49 33.4,65.3 34.2,66.1 v44.2,66.1 | v58.5,64.1 62.75,59.85 U$9.INHA
PJ0
  Bottom 0.152: 47.12,63.73 IC1.116
PK0
  Bottom 0.152: 38.89,57.33 IC1.18
PK1
  Bottom 0.152: IC1.19 38.5,56.8
PP0  (via drill 0.35)
  Top 0.152: v61.7,58.6 65.8,58.6 66.6,57.8 v66.8,57.8
  Bottom 0.152: IC1.118 50.6,62.9 52.2,61.3 54.6,61.3 56.1,59.8 59.8,59.8 61,58.6 v61.7,58.6 | 65.25,54.45 U$9.INLC 65.25,56.05 66.1,56.9 66.1,57.1 v66.8,57.8
PP1  (via drill 0.35)
  Top 0.152: v60.5,57.5 61,57 v65.2,57
  Bottom 0.152: IC1.119 50.5,62.5 52.1,60.9 54.4,60.9 56,59.3 59.4,59.3 60.5,58.2 v60.5,57.5 | v65.2,57 65.2,56.9 64.75,56.45 U$9.INHC
PQ0
  Bottom 0.152: U$9.CAL 60.55,53.95 57.8,56.7 46.4,56.7 46,56.3 44.2,56.3 44.1,56.4 IC1.5
PQ1
  Bottom 0.152: U$9.ENABLE 57.45,56.3 46.6,56.3 46.2,55.9 44.1,55.9 43.7,56.3 IC1.6
RBIAS
  Bottom 0.152: R24.2 30.59,69.09 30.8,69.3 IC1.59
SCK
  Bottom 0.152: D2.A 19.16,67.17 R33.2 IC3.5
SH1  (via drill 0.35)
  Top 0.152: U$12.2 14.08,30.58 v14.9,31.4
  Bottom 0.152: U$9.SHA 66.55,50.22 66.56,50.2 68.4,50.2 68.9,49.7 68.9,16 64.4,11.5 63.3,11.5 61.1,9.3 60.4,9.3 58.2,7.1 56.6,7.1 54.6,5.1 52.1,5.1 50.9,3.9 47.4,3.9 46.3,2.8 42.4,2.8 41.4,1.8 39.7,1.8 38.7,2.8 34.7,2.8 34.1,3.4 30.5,3.4 29.1,4.8 26.3,4.8 24.5,6.6 22.2,6.6 19.7,9.1 17.9,9.1 14.7,12.3 13.9,12.3 12.5,13.7 12.5,14 12.1,14.4 12.1,20.2 13.9,22 13.9,28.3 15.7,30.1 15.7,30.6 v14.9,31.4
SH2  (via drill 0.35)
  Top 0.152: U$11.2 20.09,19.81 v19.3,20.6
  Bottom 0.152: v19.3,20.6 20.8,19.1 27.9,19.1 28.4,18.6 28.4,15.8 27.3,14.7 27.3,8.6 28,7.9 31.3,7.9 32.7,6.5 36.2,6.5 36.8,5.9 44.7,5.9 45.9,7.1 49.3,7.1 50.4,8.2 53.1,8.2 55.2,10.3 56.6,10.3 59.1,12.8 59.9,12.8 64.25,17.15 U$9.SHB
SH3  (via drill 0.35)
  Top 0.152: U$10.2 31.58,11.2 29.8,11.2 v29.7,11.3
  Bottom 0.152: v29.7,11.3 29.1,11.3 28.8,11 28.8,9.6 29,9.4 31.8,9.4 33.3,7.9 36.7,7.9 37.4,7.2 43.9,7.2 45.3,8.6 48.8,8.6 49.8,9.6 52.4,9.6 54.6,11.8 55.8,11.8 58.4,14.4 59.3,14.4 62.75,17.85 U$9.SHC
SWCLK
  Bottom 0.152: J3.3 56.43,65.43 55.2,64.2 53.3,64.2 52.8,64.7 52.8,65.8 52.1,66.5 52.1,68 50.8,69.3 48.8,69.3 48,70.1 IC1.100
SWDIO
  Bottom 0.152: IC1.99 48.2,70.5 49,69.7 51,69.7 52.5,68.2 52.5,66.9 53.97,65.43 J3.4
SWO
  Bottom 0.152: IC1.97 48.4,71.3 49.2,70.5 51.6,70.5 J3.6
TDI
  Bottom 0.152: J3.5 55.4,66.7 53.3,66.7 52.9,67.1 52.9,68.4 51.2,70.1 49.1,70.1 48.3,70.9 IC1.98
VBAT
  Bottom 0.152: IC1.68 34.5,73.6 34.9,74 36.5,74 | 36.6,74 36.5,74 | 36.5,74 36.78,74.28
VDDC  (via drill 0.35)
  Top 0.152: v42.7,71.2 v44.6,69.3
  Bottom 0.152: C21.1 42.07,74.46 C30.1 42.1,74.35 42.1,72.79 42.08,72.77 IC1.87 42.09,72.72 42.09,71.81 v42.7,71.2 | v42.7,71.2 | v44.6,69.3 | v44.6,69.3 45.29,68.61 45.29,65.26 45.75,64.8 45.75,64.34 45.99,64.1 IC1.115 48,64.1 48.5,63.6 49.3,63.6 C29.1
VREFA  (via drill 0.35)
  Top 0.152: R25.1 42.5,60.61 42.6,60.51 v42.6,59.5
  Bottom 0.152: IC1.9 42.5,58.3 42.6,58.4 v42.6,59.5
XOSC0
  Bottom 0.152: 33.66,72.85 IC1.66 33.7,73.6 33.2,74.1 31.69,74.1 C24.1 | 31.59,74.3 C24.1 | C24.1 29.66,72.88 X2.P$1
XOSC1
  Bottom 0.152: 33.07,74.83 C25.1 33.17,74.73 34.1,73.8 IC1.67 | IC1.67 34.1,72 | IC1.67 34.1,71.8 34,71.7 32.7,71.7 X2.P$2

## Text on the board
tPlace: AVOCADO V1.0 / WILDCAT ROBOT DESIGN STUDIO | NRST | SWO | TDI | SWDIO | SWCLK | ALLEN / AKASH NATHAN RACHEL / RYAN TSONG WEILIN | PA0 | PA1 | 5V | M1 | GND | GND | 24V | 24V
bPlace: NRST | TDI | SWO | SWCLK | SWDIO | PA1 | PA0